# Altium schematic sheet 11.SchDoc
size 450 x 304 mm
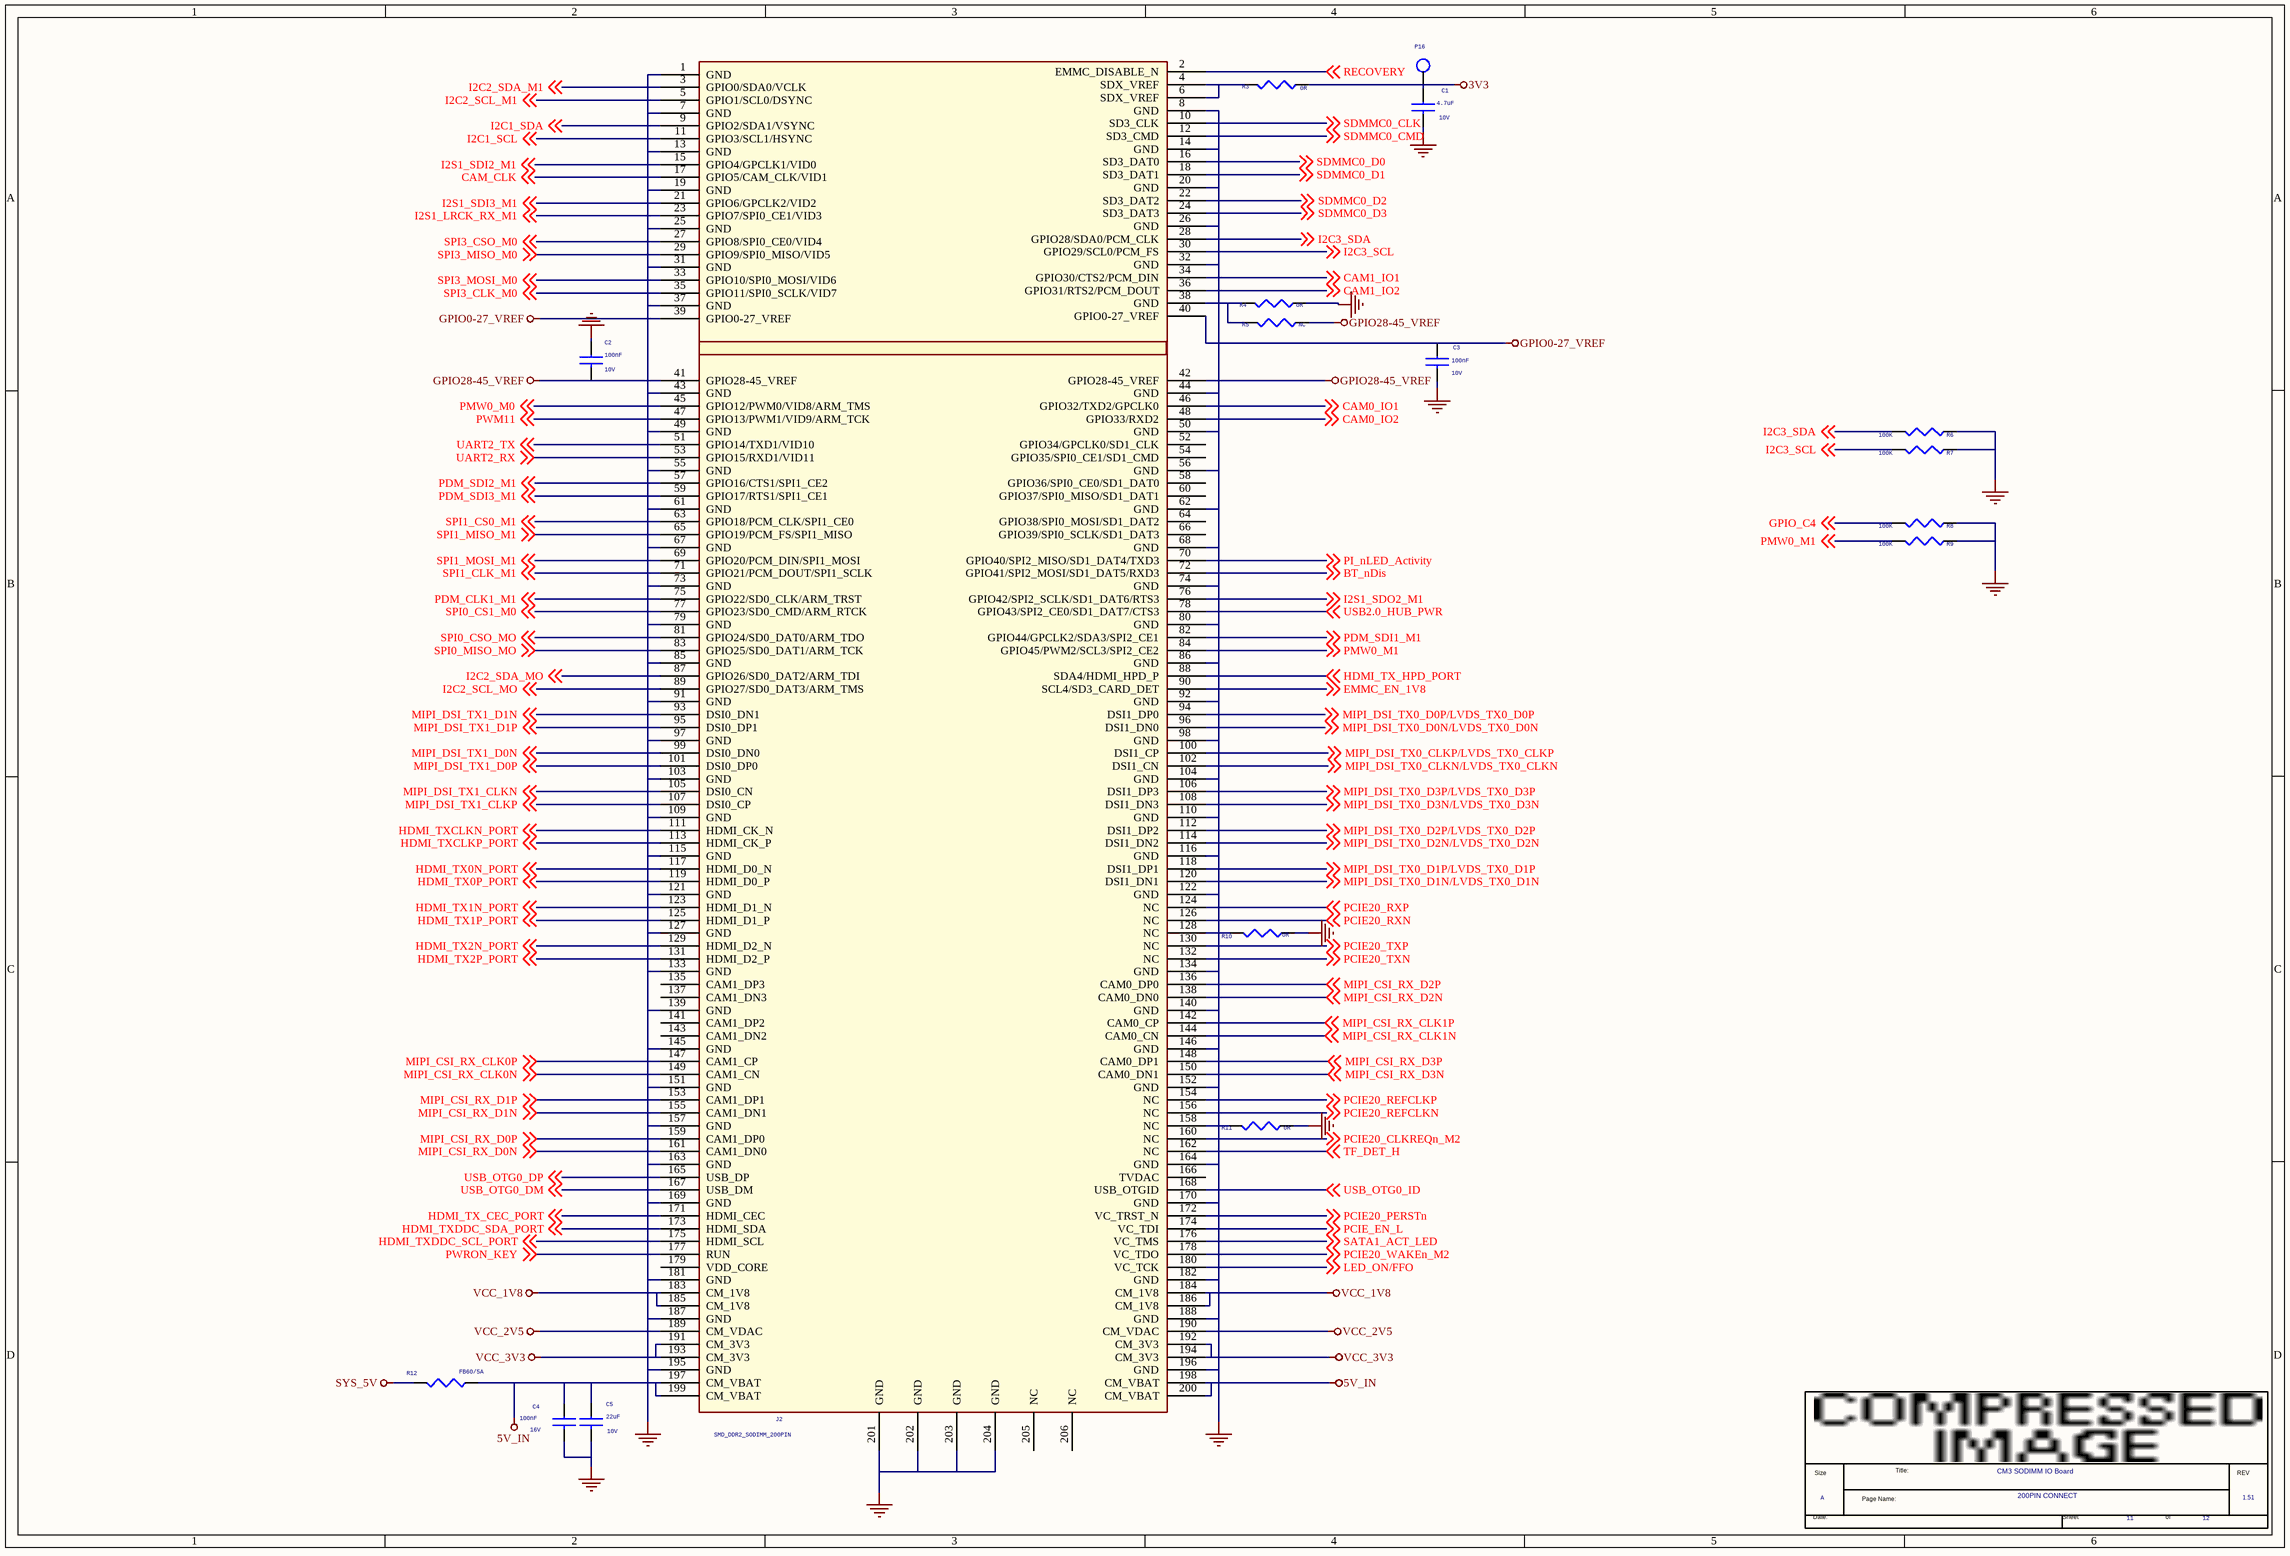
[diagram p0: 11.SchDoc]

## Parts
*  Page Count: 12  Page Number: 11  Page Size: A  Title: CM3 SODIMM IO Board  RevCode: 1.51  Doc: 200PIN CONNECT  (hidden comment: radxa_1010)  (graphical)
C1  4.7uF  Voltage: 10V  [C0402]
C2  100nF  Voltage: 10V  [C0402]
C3  100nF  Voltage: 10V  [C0402]
C4  100nF  Voltage: 16V  [C0402]
C5  22uF  Voltage: 10V  [C0603]
J2  SMD_DDR2_SODIMM_200PIN  [FCI_10033853_CM]
P16  TEST  [TEST]  (value not drawn)
R3  0R  [R0402]
R4  0R  [R0402]
R5  NC  [R0402]
R6  100K  [R0402]
R7  100K  [R0402]
R8  100K  [R0402]
R9  100K  [R0402]
R10  0R  [R0402]
R11  0R  [R0402]
R12  FB60/5A  [R0402]

## Nets
3V3: C1.1 P16.1 R3.2
5V_IN: C4.1 C5.1 J2.197(CM_VBAT) J2.198(CM_VBAT) J2.199(CM_VBAT) J2.200(CM_VBAT) R12.2
GND: C1.2 C2.1 C3.2 C4.2 C5.2 J2.1(GND) J2.7(GND) J2.8(GND) J2.13(GND) J2.14(GND) J2.19(GND) J2.20(GND) J2.25(GND) J2.26(GND) J2.31(GND) J2.32(GND) J2.37(GND) J2.43(GND) J2.44(GND) J2.49(GND) J2.50(GND) J2.55(GND) J2.56(GND) J2.61(GND) J2.62(GND) J2.67(GND) J2.68(GND) J2.73(GND) J2.74(GND) J2.79(GND) J2.80(GND) J2.85(GND) J2.86(GND) J2.91(GND) J2.92(GND) J2.97(GND) J2.98(GND) J2.103(GND) J2.104(GND) J2.109(GND) J2.110(GND) J2.115(GND) J2.116(GND) J2.121(GND) J2.122(GND) J2.127(GND) J2.133(GND) J2.134(GND) J2.139(GND) J2.140(GND) J2.145(GND) J2.146(GND) J2.151(GND) J2.152(GND) J2.157(GND) J2.163(GND) J2.164(GND) J2.169(GND) J2.170(GND) J2.181(GND) J2.182(GND) J2.187(GND) J2.188(GND) J2.195(GND) J2.196(GND) J2.201(GND) J2.202(GND) J2.203(GND) J2.204(GND) R4.2 R6.1 R7.1 R8.1 R9.1 R10.2 R11.2
GPIO0-27_VREF: C3.1 J2.39(GPIO0-27_VREF) J2.40(GPIO0-27_VREF)
GPIO28-45_VREF: C2.2 J2.41(GPIO28-45_VREF) J2.42(GPIO28-45_VREF) R5.2
SYS_5V: R12.1
VCC_1V8: J2.183(CM_1V8) J2.184(CM_1V8) J2.185(CM_1V8) J2.186(CM_1V8)
VCC_2V5: J2.189(CM_VDAC) J2.190(CM_VDAC)
VCC_3V3: J2.191(CM_3V3) J2.192(CM_3V3) J2.193(CM_3V3) J2.194(CM_3V3)
BT_nDis: J2.72(GPIO41/SPI2_MOSI/SD1_DAT5/RXD3) ; off-sheet BT_nDis
CAM0_IO1: J2.46(GPIO32/TXD2/GPCLK0) ; off-sheet CAM0_IO1
CAM0_IO2: J2.48(GPIO33/RXD2) ; off-sheet CAM0_IO2
CAM1_IO1: J2.34(GPIO30/CTS2/PCM_DIN) ; off-sheet CAM1_IO1
CAM1_IO2: J2.36(GPIO31/RTS2/PCM_DOUT) ; off-sheet CAM1_IO2
CAM_CLK: J2.17(GPIO5/CAM_CLK/VID1) ; off-sheet CAM_CLK
EMMC_EN_1V8: J2.90(SCL4/SD3_CARD_DET) ; off-sheet EMMC_EN_1V8
GPIO_C4: R8.2 ; off-sheet GPIO_C4
HDMI_TX0N_PORT: J2.117(HDMI_D0_N) ; off-sheet HDMI_TX0N_PORT
HDMI_TX0P_PORT: J2.119(HDMI_D0_P) ; off-sheet HDMI_TX0P_PORT
HDMI_TX1N_PORT: J2.123(HDMI_D1_N) ; off-sheet HDMI_TX1N_PORT
HDMI_TX1P_PORT: J2.125(HDMI_D1_P) ; off-sheet HDMI_TX1P_PORT
HDMI_TX2N_PORT: J2.129(HDMI_D2_N) ; off-sheet HDMI_TX2N_PORT
HDMI_TX2P_PORT: J2.131(HDMI_D2_P) ; off-sheet HDMI_TX2P_PORT
HDMI_TX_CEC_PORT: J2.171(HDMI_CEC) ; off-sheet HDMI_TX_CEC_PORT
HDMI_TX_HPD_PORT: J2.88(SDA4/HDMI_HPD_P) ; off-sheet HDMI_TX_HPD_PORT
HDMI_TXCLKN_PORT: J2.111(HDMI_CK_N) ; off-sheet HDMI_TXCLKN_PORT
HDMI_TXCLKP_PORT: J2.113(HDMI_CK_P) ; off-sheet HDMI_TXCLKP_PORT
HDMI_TXDDC_SCL_PORT: J2.175(HDMI_SCL) ; off-sheet HDMI_TXDDC_SCL_PORT
HDMI_TXDDC_SDA_PORT: J2.173(HDMI_SDA) ; off-sheet HDMI_TXDDC_SDA_PORT
I2C1_SCL: J2.11(GPIO3/SCL1/HSYNC) ; off-sheet I2C1_SCL
I2C1_SDA: J2.9(GPIO2/SDA1/VSYNC) ; off-sheet I2C1_SDA
I2C2_SCL_M1: J2.5(GPIO1/SCL0/DSYNC) ; off-sheet I2C2_SCL_M1
I2C2_SCL_MO: J2.89(GPIO27/SD0_DAT3/ARM_TMS) ; off-sheet I2C2_SCL_MO
I2C2_SDA_M1: J2.3(GPIO0/SDA0/VCLK) ; off-sheet I2C2_SDA_M1
I2C2_SDA_MO: J2.87(GPIO26/SD0_DAT2/ARM_TDI) ; off-sheet I2C2_SDA_MO
I2C3_SCL: J2.30(GPIO29/SCL0/PCM_FS) R7.2 ; off-sheet I2C3_SCL
I2C3_SDA: J2.28(GPIO28/SDA0/PCM_CLK) R6.2 ; off-sheet I2C3_SDA
I2S1_LRCK_RX_M1: J2.23(GPIO7/SPI0_CE1/VID3) ; off-sheet I2S1_LRCK_RX_M1
I2S1_SDI2_M1: J2.15(GPIO4/GPCLK1/VID0) ; off-sheet I2S1_SDI2_M1
I2S1_SDI3_M1: J2.21(GPIO6/GPCLK2/VID2) ; off-sheet I2S1_SDI3_M1
I2S1_SDO2_M1: J2.76(GPIO42/SPI2_SCLK/SD1_DAT6/RTS3) ; off-sheet I2S1_SDO2_M1
LED_ON/FFO: J2.180(VC_TCK) ; off-sheet LED_ON/FFO
MIPI_CSI_RX_CLK0N: J2.149(CAM1_CN) ; off-sheet MIPI_CSI_RX_CLK0N
MIPI_CSI_RX_CLK0P: J2.147(CAM1_CP) ; off-sheet MIPI_CSI_RX_CLK0P
MIPI_CSI_RX_CLK1N: J2.144(CAM0_CN) ; off-sheet MIPI_CSI_RX_CLK1N
MIPI_CSI_RX_CLK1P: J2.142(CAM0_CP) ; off-sheet MIPI_CSI_RX_CLK1P
MIPI_CSI_RX_D0N: J2.161(CAM1_DN0) ; off-sheet MIPI_CSI_RX_D0N
MIPI_CSI_RX_D0P: J2.159(CAM1_DP0) ; off-sheet MIPI_CSI_RX_D0P
MIPI_CSI_RX_D1N: J2.155(CAM1_DN1) ; off-sheet MIPI_CSI_RX_D1N
MIPI_CSI_RX_D1P: J2.153(CAM1_DP1) ; off-sheet MIPI_CSI_RX_D1P
MIPI_CSI_RX_D2N: J2.138(CAM0_DN0) ; off-sheet MIPI_CSI_RX_D2N
MIPI_CSI_RX_D2P: J2.136(CAM0_DP0) ; off-sheet MIPI_CSI_RX_D2P
MIPI_CSI_RX_D3N: J2.150(CAM0_DN1) ; off-sheet MIPI_CSI_RX_D3N
MIPI_CSI_RX_D3P: J2.148(CAM0_DP1) ; off-sheet MIPI_CSI_RX_D3P
MIPI_DSI_TX0_CLKN/LVDS_TX0_CLKN: J2.102(DSI1_CN) ; off-sheet MIPI_DSI_TX0_CLKN/LVDS_TX0_CLKN
MIPI_DSI_TX0_CLKP/LVDS_TX0_CLKP: J2.100(DSI1_CP) ; off-sheet MIPI_DSI_TX0_CLKP/LVDS_TX0_CLKP
MIPI_DSI_TX0_D0N/LVDS_TX0_D0N: J2.96(DSI1_DN0) ; off-sheet MIPI_DSI_TX0_D0N/LVDS_TX0_D0N
MIPI_DSI_TX0_D0P/LVDS_TX0_D0P: J2.94(DSI1_DP0) ; off-sheet MIPI_DSI_TX0_D0P/LVDS_TX0_D0P
MIPI_DSI_TX0_D1N/LVDS_TX0_D1N: J2.120(DSI1_DN1) ; off-sheet MIPI_DSI_TX0_D1N/LVDS_TX0_D1N
MIPI_DSI_TX0_D1P/LVDS_TX0_D1P: J2.118(DSI1_DP1) ; off-sheet MIPI_DSI_TX0_D1P/LVDS_TX0_D1P
MIPI_DSI_TX0_D2N/LVDS_TX0_D2N: J2.114(DSI1_DN2) ; off-sheet MIPI_DSI_TX0_D2N/LVDS_TX0_D2N
MIPI_DSI_TX0_D2P/LVDS_TX0_D2P: J2.112(DSI1_DP2) ; off-sheet MIPI_DSI_TX0_D2P/LVDS_TX0_D2P
MIPI_DSI_TX0_D3N/LVDS_TX0_D3N: J2.108(DSI1_DN3) ; off-sheet MIPI_DSI_TX0_D3N/LVDS_TX0_D3N
MIPI_DSI_TX0_D3P/LVDS_TX0_D3P: J2.106(DSI1_DP3) ; off-sheet MIPI_DSI_TX0_D3P/LVDS_TX0_D3P
MIPI_DSI_TX1_CLKN: J2.105(DSI0_CN) ; off-sheet MIPI_DSI_TX1_CLKN
MIPI_DSI_TX1_CLKP: J2.107(DSI0_CP) ; off-sheet MIPI_DSI_TX1_CLKP
MIPI_DSI_TX1_D0N: J2.99(DSI0_DN0) ; off-sheet MIPI_DSI_TX1_D0N
MIPI_DSI_TX1_D0P: J2.101(DSI0_DP0) ; off-sheet MIPI_DSI_TX1_D0P
MIPI_DSI_TX1_D1N: J2.93(DSI0_DN1) ; off-sheet MIPI_DSI_TX1_D1N
MIPI_DSI_TX1_D1P: J2.95(DSI0_DP1) ; off-sheet MIPI_DSI_TX1_D1P
PCIE20_CLKREQn_M2: J2.160(NC) ; off-sheet PCIE20_CLKREQn_M2
PCIE20_PERSTn: J2.172(VC_TRST_N) ; off-sheet PCIE20_PERSTn
PCIE20_REFCLKN: J2.156(NC) ; off-sheet PCIE20_REFCLKN
PCIE20_REFCLKP: J2.154(NC) ; off-sheet PCIE20_REFCLKP
PCIE20_RXN: J2.126(NC) ; off-sheet PCIE20_RXN
PCIE20_RXP: J2.124(NC) ; off-sheet PCIE20_RXP
PCIE20_TXN: J2.132(NC) ; off-sheet PCIE20_TXN
PCIE20_TXP: J2.130(NC) ; off-sheet PCIE20_TXP
PCIE20_WAKEn_M2: J2.178(VC_TDO) ; off-sheet PCIE20_WAKEn_M2
PCIE_EN_L: J2.174(VC_TDI) ; off-sheet PCIE_EN_L
PDM_CLK1_M1: J2.75(GPIO22/SD0_CLK/ARM_TRST) ; off-sheet PDM_CLK1_M1
PDM_SDI1_M1: J2.82(GPIO44/GPCLK2/SDA3/SPI2_CE1) ; off-sheet PDM_SDI1_M1
PDM_SDI2_M1: J2.57(GPIO16/CTS1/SPI1_CE2) ; off-sheet PDM_SDI2_M1
PDM_SDI3_M1: J2.59(GPIO17/RTS1/SPI1_CE1) ; off-sheet PDM_SDI3_M1
PI_nLED_Activity: J2.70(GPIO40/SPI2_MISO/SD1_DAT4/TXD3) ; off-sheet PI_nLED_Activity
PMW0_M0: J2.45(GPIO12/PWM0/VID8/ARM_TMS) ; off-sheet PMW0_M0
PMW0_M1: J2.84(GPIO45/PWM2/SCL3/SPI2_CE2) R9.2 ; off-sheet PMW0_M1
PWM11: J2.47(GPIO13/PWM1/VID9/ARM_TCK) ; off-sheet PWM11
PWRON_KEY: J2.177(RUN) ; off-sheet PWRON_KEY
RECOVERY: J2.2(EMMC_DISABLE_N) ; off-sheet RECOVERY
SATA1_ACT_LED: J2.176(VC_TMS) ; off-sheet SATA1_ACT_LED
SDMMC0_CLK: J2.10(SD3_CLK) ; off-sheet SDMMC0_CLK
SDMMC0_CMD: J2.12(SD3_CMD) ; off-sheet SDMMC0_CMD
SDMMC0_D0: J2.16(SD3_DAT0) ; off-sheet SDMMC0_D0
SDMMC0_D1: J2.18(SD3_DAT1) ; off-sheet SDMMC0_D1
SDMMC0_D2: J2.22(SD3_DAT2) ; off-sheet SDMMC0_D2
SDMMC0_D3: J2.24(SD3_DAT3) ; off-sheet SDMMC0_D3
SPI0_CS1_M0: J2.77(GPIO23/SD0_CMD/ARM_RTCK) ; off-sheet SPI0_CS1_M0
SPI0_CSO_MO: J2.81(GPIO24/SD0_DAT0/ARM_TDO) ; off-sheet SPI0_CSO_MO
SPI0_MISO_MO: J2.83(GPIO25/SD0_DAT1/ARM_TCK) ; off-sheet SPI0_MISO_MO
SPI1_CLK_M1: J2.71(GPIO21/PCM_DOUT/SPI1_SCLK) ; off-sheet SPI1_CLK_M1
SPI1_CS0_M1: J2.63(GPIO18/PCM_CLK/SPI1_CE0) ; off-sheet SPI1_CS0_M1
SPI1_MISO_M1: J2.65(GPIO19/PCM_FS/SPI1_MISO) ; off-sheet SPI1_MISO_M1
SPI1_MOSI_M1: J2.69(GPIO20/PCM_DIN/SPI1_MOSI) ; off-sheet SPI1_MOSI_M1
SPI3_CLK_M0: J2.35(GPIO11/SPI0_SCLK/VID7) ; off-sheet SPI3_CLK_M0
SPI3_CSO_M0: J2.27(GPIO8/SPI0_CE0/VID4) ; off-sheet SPI3_CSO_M0
SPI3_MISO_M0: J2.29(GPIO9/SPI0_MISO/VID5) ; off-sheet SPI3_MISO_M0
SPI3_MOSI_M0: J2.33(GPIO10/SPI0_MOSI/VID6) ; off-sheet SPI3_MOSI_M0
TF_DET_H: J2.162(NC) ; off-sheet TF_DET_H
UART2_RX: J2.53(GPIO15/RXD1/VID11) ; off-sheet UART2_RX
UART2_TX: J2.51(GPIO14/TXD1/VID10) ; off-sheet UART2_TX
USB2.0_HUB_PWR: J2.78(GPIO43/SPI2_CE0/SD1_DAT7/CTS3) ; off-sheet USB2.0_HUB_PWR
USB_OTG0_DM: J2.167(USB_DM) ; off-sheet USB_OTG0_DM
USB_OTG0_DP: J2.165(USB_DP) ; off-sheet USB_OTG0_DP
USB_OTG0_ID: J2.168(USB_OTGID) ; off-sheet USB_OTG0_ID
NetJ2_4: J2.4(SDX_VREF) J2.6(SDX_VREF) R3.1
NetJ2_38: J2.38(GND) R4.1 R5.1
NetJ2_128: J2.128(NC) R10.1
NetJ2_158: J2.158(NC) R11.1

Not connected (* = marked no-connect by the designer): J2 52(GPIO34/GPCLK0/SD1_CLK) 54(GPIO35/SPI0_CE1/SD1_CMD) 58(GPIO36/SPI0_CE0/SD1_DAT0) 60(GPIO37/SPI0_MISO/SD1_DAT1) 64(GPIO38/SPI0_MOSI/SD1_DAT2) 66(GPIO39/SPI0_SCLK/SD1_DAT3) 135(CAM1_DP3) 137(CAM1_DN3) 141(CAM1_DP2) 143(CAM1_DN2) 166(TVDAC) 179(VDD_CORE) 205(NC) 206(NC)

## Notes on the sheet
- (in symbol radxa_1010) Size; Title:; REV; Page Name:; Date:; Sheet; of

## Library data of the parts
C1 = CAP NP_0: cap,1.00uF,+/-10%,10V,X5R,C0402; Manufacturer PN: C1005X5R1A105K050BB; Manufacturer: TDK; Tolerance: 10%; Priority: A; Dielectric: X5R; Created by: JJJ; Part Type: C0402; RK PN: C1005X5R1A105K050BB
C2 C3 = CAP NP_0: cap,100.00nF,+/-10%,10V,X5R,C0201; Manufacturer: TDK; RK PN: C0603X5R1A104K030BC; Priority: A; Tolerance: 10%; Dielectric: X5R; Part Type: C0201; Manufacturer PN: C0603X5R1A104K030BC; Created by: JJJ
C4 = CAP NP_0_Dup2: cap,100.00nF,+/-10%,16V,X5R,C0402; Manufacturer PN: C1005X5R1C104K050BA; Manufacturer: TDK; Tolerance: 10%; Priority: A; Dielectric: X5R; Created by: JJJ; Part Type: C0402; RK PN: C1005X5R1C104K050BA
C5 = CAP NP_0: cap,10.00uF,+/-10%,10V,X5R,C0805; Manufacturer: TDK; RK PN: C2012X5R1A106K125AB; Priority: A; Tolerance: 10%; Dielectric: X5R; Part Type: C0805; Manufacturer PN: C2012X5R1A106K125AB; Created by: JJJ
J2 = CON_200W_DDR2SODIMM_CM_6
P16 = TESTPOINT1
R3 R4 R6 R8 R11 R12 = RESISTOR_0: 通用厚膜电阻,220K,+/-5%,R0402,1/16W.; Manufacturer PN: RC0402JR-07220KL; Manufacturer: YAGEO; Tolerance: 5%; Wattage: 1/16W; Priority: A; Created by: YTL; Part Type: 通用厚膜电阻; RK PN: RC0402JR-07220KL
R5 R7 R9 R10 = RESISTOR_0: 通用厚膜电阻,220K,+/-5%,R0402,1/16W.; Manufacturer: YAGEO; Tolerance: 5%; RK PN: RC0402JR-07220KL; Priority: A; Wattage: 1/16W; Part Type: 通用厚膜电阻; Manufacturer PN: RC0402JR-07220KL; Created by: YTL
* = radxa_1010: Page Create Date: March  8, 1995